# Altium schematic sheet Mcu.SchDoc
size A4
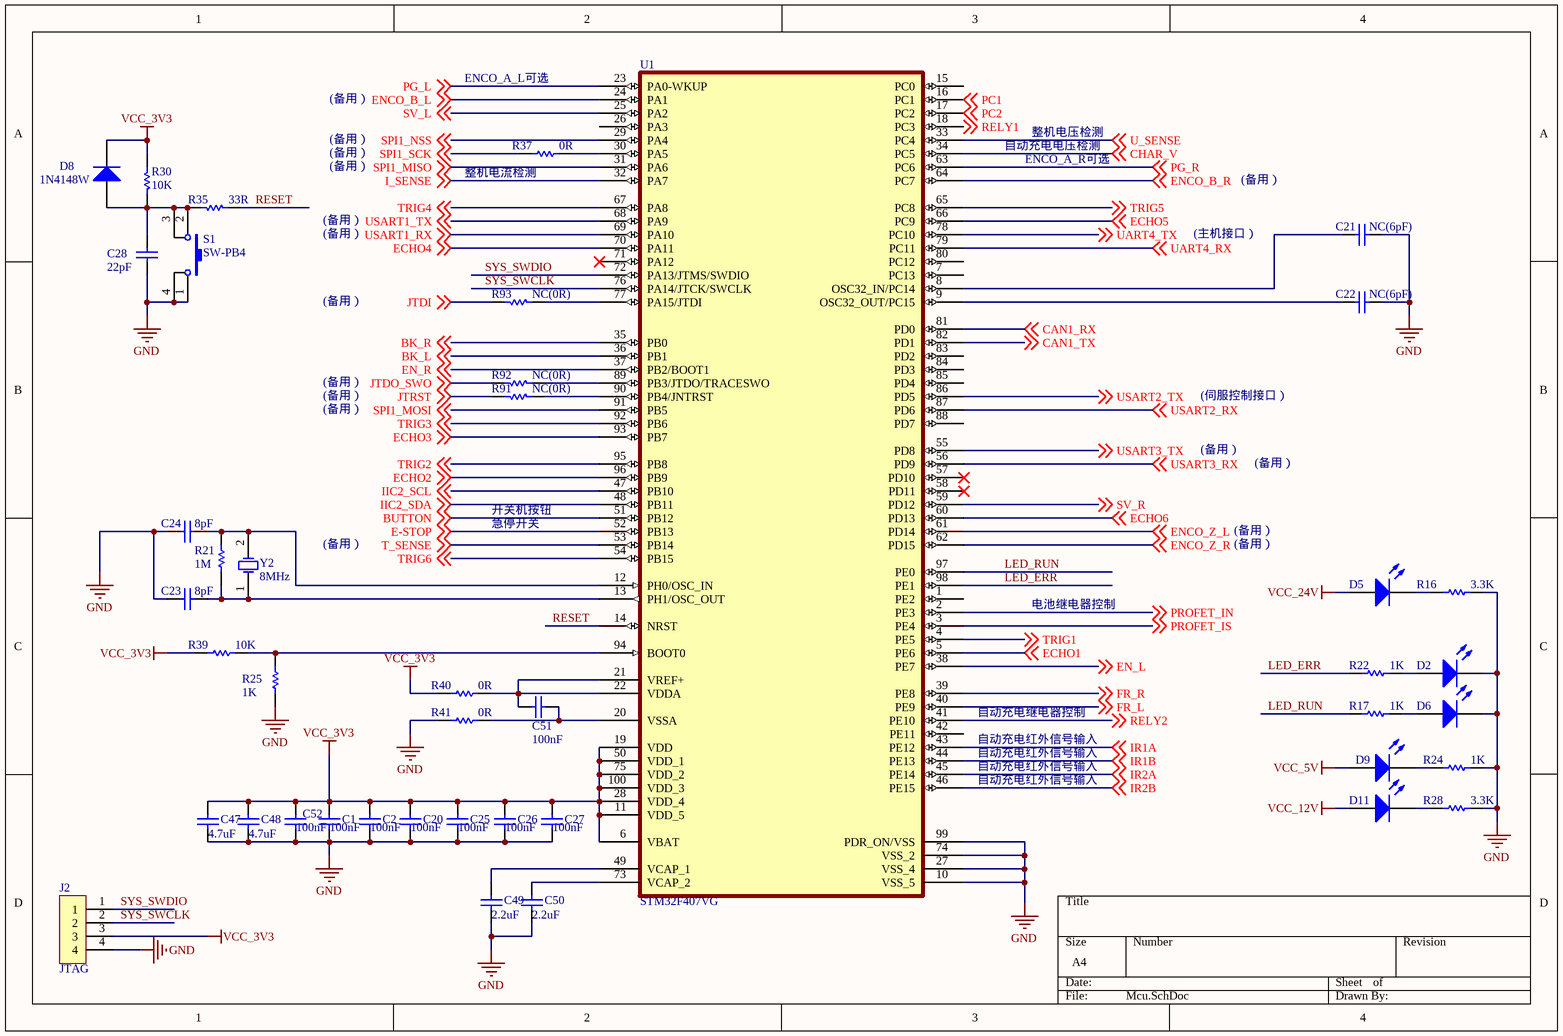
[diagram p0: Mcu.SchDoc]

## Parts
C1  value 100nF  [C0805]  (hidden comment: Cap)
C2  value 100nF  [C0805]  (hidden comment: Cap)
C20  value 100nF  [C0805]  (hidden comment: Cap)
C21  NC(6pF)  [C0805]
C22  NC(6pF)  [C0805]
C23  8pF  [C0805]
C24  8pF  [C0805]
C25  value 100nF  [C0805]  (hidden comment: Cap)
C26  value 100nF  [C0805]  (hidden comment: Cap)
C27  value 100nF  [C0805]  (hidden comment: Cap)
C28  value 22pF  [C0805]  (hidden comment: Cap)
C47  value 4.7uF  [C0805]  (hidden comment: Cap)
C48  value 4.7uF  [C0805]  (hidden comment: Cap)
C49  value 2.2uF  [C0805]  (hidden comment: Cap)
C50  value 2.2uF  [C0805]  (hidden comment: Cap)
C51  value 100nF  [C0805]  (hidden comment: Cap)
C52  value 100nF  [C0805]  (hidden comment: Cap)
D2  LED0  [LED-H-R2.54]  (value not drawn)
D5  LED0  [LED-H-R2.54]  (value not drawn)
D6  LED0  [LED-H-R2.54]  (value not drawn)
D8  value 1N4148W  [1206]  (hidden comment: Diode)
D9  LED0  [LED-H-R2.54]  (value not drawn)
D11  LED0  [LED-H-R2.54]  (value not drawn)
J2  JTAG  [PORT-SIP4-2.54]
R16  value 3.3K  [R0805]  (hidden comment: Res1)
R17  value 1K  [R0805]  (hidden comment: Res1)
R21  value 1M  [R0805]  (hidden comment: Res1)
R22  value 1K  [R0805]  (hidden comment: Res1)
R24  value 1K  [R0805]  (hidden comment: Res1)
R25  value 1K  [R0805]  (hidden comment: Res1)
R28  value 3.3K  [R0805]  (hidden comment: Res1)
R30  value 10K  [R0805]  (hidden comment: Res1)
R35  value 33R  [R0805]  (hidden comment: Res1)
R37  value 0R  [R0805]  (hidden comment: Res1)
R39  value 10K  [R0805]  (hidden comment: Res1)
R40  value 0R  [R0805]  (hidden comment: Res1)
R41  value 0R  [R0805]  (hidden comment: Res1)
R91  value NC(0R)  [R0805]  (hidden comment: Res1)
R92  value NC(0R)  [R0805]  (hidden comment: Res1)
R93  value NC(0R)  [R0805]  (hidden comment: Res1)
S1  SW-PB4  [RESET-SMD-1O4]
U1  STM32F407VG  [100T1_N]
Y2  8MHz  [CLK_3.1]

## Nets
GND: C1.2 C2.2 C20.2 C21.1 C22.1 C23.2 C24.2 C25.2 C26.2 C27.2 C28.1 C47.2 C48.2 C49.2 C50.2 C52.2 D2.2(K) D6.2(K) J2.4 R16.1 R24.1 R25.1 R28.1 R41.2 S1.1 S1.4 U1.10(VSS_5) U1.27(VSS_4) U1.74(VSS_2) U1.99(PDR_ON/VSS)
VCC_3V3: C1.1 C2.1 C20.1 C25.1 C26.1 C27.1 C47.1 C48.1 C52.1 D8.2(K) J2.3 R30.2 R39.2 R40.2 U1.6(VBAT) U1.11(VDD_5) U1.19(VDD) U1.28(VDD_4) U1.50(VDD_1) U1.75(VDD_2) U1.100(VDD_3)
VCC_5V: D9.1(A)
VCC_12V: D11.1(A)
VCC_24V: D5.1(A)
BK_L: U1.36(PB1) ; off-sheet BK_L
BK_R: U1.35(PB0) ; off-sheet BK_R
BUTTON: U1.51(PB12) ; off-sheet BUTTON
CAN1_RX: U1.81(PD0) ; off-sheet CAN1_RX
CAN1_TX: U1.82(PD1) ; off-sheet CAN1_TX
CHAR_V: U1.34(PC5) ; off-sheet CHAR_V
E-STOP: U1.52(PB13) ; off-sheet E-STOP
ECHO1: U1.5(PE6) ; off-sheet ECHO1
ECHO2: U1.96(PB9) ; off-sheet ECHO2
ECHO3: U1.93(PB7) ; off-sheet ECHO3
ECHO4: U1.70(PA11) ; off-sheet ECHO4
ECHO5: U1.66(PC9) ; off-sheet ECHO5
ECHO6: U1.60(PD13) ; off-sheet ECHO6
EN_L: U1.38(PE7) ; off-sheet EN_L
EN_R: U1.37(PB2/BOOT1) ; off-sheet EN_R
ENCO_B_L: U1.24(PA1) ; off-sheet ENCO_B_L
ENCO_B_R: U1.64(PC7) ; off-sheet ENCO_B_R
ENCO_Z_L: U1.61(PD14) ; off-sheet ENCO_Z_L
ENCO_Z_R: U1.62(PD15) ; off-sheet ENCO_Z_R
FR_L: U1.40(PE9) ; off-sheet FR_L
FR_R: U1.39(PE8) ; off-sheet FR_R
I_SENSE: U1.32(PA7) ; off-sheet I_SENSE
IIC2_SCL: U1.47(PB10) ; off-sheet IIC2_SCL
IIC2_SDA: U1.48(PB11) ; off-sheet IIC2_SDA
IR1A: U1.43(PE12) ; off-sheet IR1A
IR1B: U1.44(PE13) ; off-sheet IR1B
IR2A: U1.45(PE14) ; off-sheet IR2A
IR2B: U1.46(PE15) ; off-sheet IR2B
JTDI: R93.2 ; off-sheet JTDI
JTDO_SWO: R92.2 ; off-sheet JTDO_SWO
JTRST: R91.2 ; off-sheet JTRST
LED_ERR: R22.2 U1.98(PE1)
LED_RUN: R17.2 U1.97(PE0)
PC1: U1.16(PC1) ; off-sheet PC1
PC2: U1.17(PC2) ; off-sheet PC2
PG_L: U1.23(PA0-WKUP) ; off-sheet PG_L
PG_R: U1.63(PC6) ; off-sheet PG_R
PROFET_IN: U1.2(PE3) ; off-sheet PROFET_IN
PROFET_IS: U1.3(PE4) ; off-sheet PROFET_IS
RELY1: U1.18(PC3) ; off-sheet RELY1
RELY2: U1.41(PE10) ; off-sheet RELY2
RESET: R35.1 U1.14(NRST)
SPI1_MISO: U1.31(PA6) ; off-sheet SPI1_MISO
SPI1_MOSI: U1.91(PB5) ; off-sheet SPI1_MOSI
SPI1_NSS: U1.29(PA4) ; off-sheet SPI1_NSS
SPI1_SCK: R37.2 ; off-sheet SPI1_SCK
SV_L: U1.25(PA2) ; off-sheet SV_L
SV_R: U1.59(PD12) ; off-sheet SV_R
SYS_SWCLK: J2.2 U1.76(PA14/JTCK/SWCLK)
SYS_SWDIO: J2.1 U1.72(PA13/JTMS/SWDIO)
T_SENSE: U1.53(PB14) ; off-sheet T_SENSE
TRIG1: U1.4(PE5) ; off-sheet TRIG1
TRIG2: U1.95(PB8) ; off-sheet TRIG2
TRIG3: U1.92(PB6) ; off-sheet TRIG3
TRIG4: U1.67(PA8) ; off-sheet TRIG4
TRIG5: U1.65(PC8) ; off-sheet TRIG5
TRIG6: U1.54(PB15) ; off-sheet TRIG6
U_SENSE: U1.33(PC4) ; off-sheet U_SENSE
UART4_RX: U1.79(PC11) ; off-sheet UART4_RX
UART4_TX: U1.78(PC10) ; off-sheet UART4_TX
USART1_RX: U1.69(PA10) ; off-sheet USART1_RX
USART1_TX: U1.68(PA9) ; off-sheet USART1_TX
USART2_RX: U1.87(PD6) ; off-sheet USART2_RX
USART2_TX: U1.86(PD5) ; off-sheet USART2_TX
USART3_RX: U1.56(PD9) ; off-sheet USART3_RX
USART3_TX: U1.55(PD8) ; off-sheet USART3_TX
NetC21_2: C21.2 U1.8(OSC32_IN/PC14)
NetC22_2: C22.2 U1.9(OSC32_OUT/PC15)
NetC23_1: C23.1 R21.1 U1.13(PH1/OSC_OUT) Y2.1(OSC1)
NetC24_1: C24.1 R21.2 U1.12(PH0/OSC_IN) Y2.2(OSC2)
NetC28_2: C28.2 D8.1(A) R30.1 R35.2 S1.2 S1.3
NetC49_1: C49.1 U1.49(VCAP_1)
NetC50_1: C50.1 U1.73(VCAP_2)
NetC51_1: C51.1 R40.1 U1.21(VREF+) U1.22(VDDA)
NetC51_2: C51.2 R41.1 U1.20(VSSA)
NetD2_1: D2.1(A) R22.1
NetD5_2: D5.2(K) R16.2
NetD6_1: D6.1(A) R17.1
NetD9_2: D9.2(K) R24.2
NetD11_2: D11.2(K) R28.2
NetR25_2: R25.2 R39.1 U1.94(BOOT0)
NetR37_1: R37.1 U1.30(PA5)
NetR91_1: R91.1 U1.90(PB4/JNTRST)
NetR92_1: R92.1 U1.89(PB3/JTDO/TRACESWO)
NetR93_1: R93.1 U1.77(PA15/JTDI)

Not connected (* = marked no-connect by the designer): U1 1(PE2) 7(PC13) 15(PC0) 26(PA3) 42(PE11) 57(PD10)* 58(PD11)* 71(PA12)* 80(PC12) 83(PD2) 84(PD3) 85(PD4) 88(PD7)

## Notes on the sheet
- (备用）
- ENCO_A_L可选
- (near R37) 整机电流检测
- 自动充电电压检测
- ENCO_A_R可选
- 整机电压检测
- (主机接口）
- (伺服控制接口）
- 开关机按钮
- 急停开关
- 电池继电器控制
- 自动充电继电器控制
- 自动充电红外信号输入

## Library data of the parts
C1 C2 C20-C28 C47-C52 = Cap: Capacitor; Published: 8-Jun-2000; LatestRevisionDate: 17-Jul-2002; LatestRevisionNote: Re-released for DXP Platform.; PackageReference: RAD-0.3; Publisher: Altium Limited; PackageDescription: Radial Cap, Thru-Hole; 2 Leads; 0.3 in Pin Spacing
  C21 C22: Value: NC(6pF)
  C23 C24: Value: 8pF
D2 D5 D6 D9 D11 = LED0: 发光二极管; Published: 8-Jun-2000; LatestRevisionDate: 08-Jul-2005; LatestRevisionNote: Mech Layer 1 removed.; PackageReference: LED-0; Publisher: Altium Limited
D8 = Diode: 二极管; Type: S01575; Published: 8-Jun-2000; LatestRevisionDate: 17-Jul-2002; LatestRevisionNote: Re-released for DXP Platform.; PackageDocument: Sep-1996; PackageReference: CD1206; Publisher: Altium Limited; Code_JEDEC: DO-214-AB
J2 = Conn_1*4_1
R16 R17 R21 R22 R24 R25 R28 R30 R35 R37 R39-R41 R91-R93 = Res1: Resistor; Published: 8-Jun-2000; LatestRevisionDate: 17-Jul-2002; LatestRevisionNote: Re-released for DXP Platform.; PackageReference: AXIAL-0.3; Publisher: Altium Limited; PackageDescription: Axial Device, Thru-Hole; 2 Leads; 0.3 in Pin Spacing
S1 = SW-PB4: 微动开关; Published: 24-Mar-1999; LatestRevisionDate: 17-Jul-2002; LatestRevisionNote: Re-released for DXP Platform.; PackageReference: SPST-2; Publisher: Altium Limited
Y2 = XTAL: X1A0000610030xx; Published: 8-Jun-2000; LatestRevisionDate: 17-Jul-2002; LatestRevisionNote: Re-released for DXP Platform.; PackageReference: R38; Publisher: Altium Limited; PackageDescription: Crystal, Thru-Hole; 2 Leads; Body 3.1 x 8.2 mm (Dia.xH)